# EAGLE schematic EGR 326 ATmega328P Board (EAGLE 6.4)
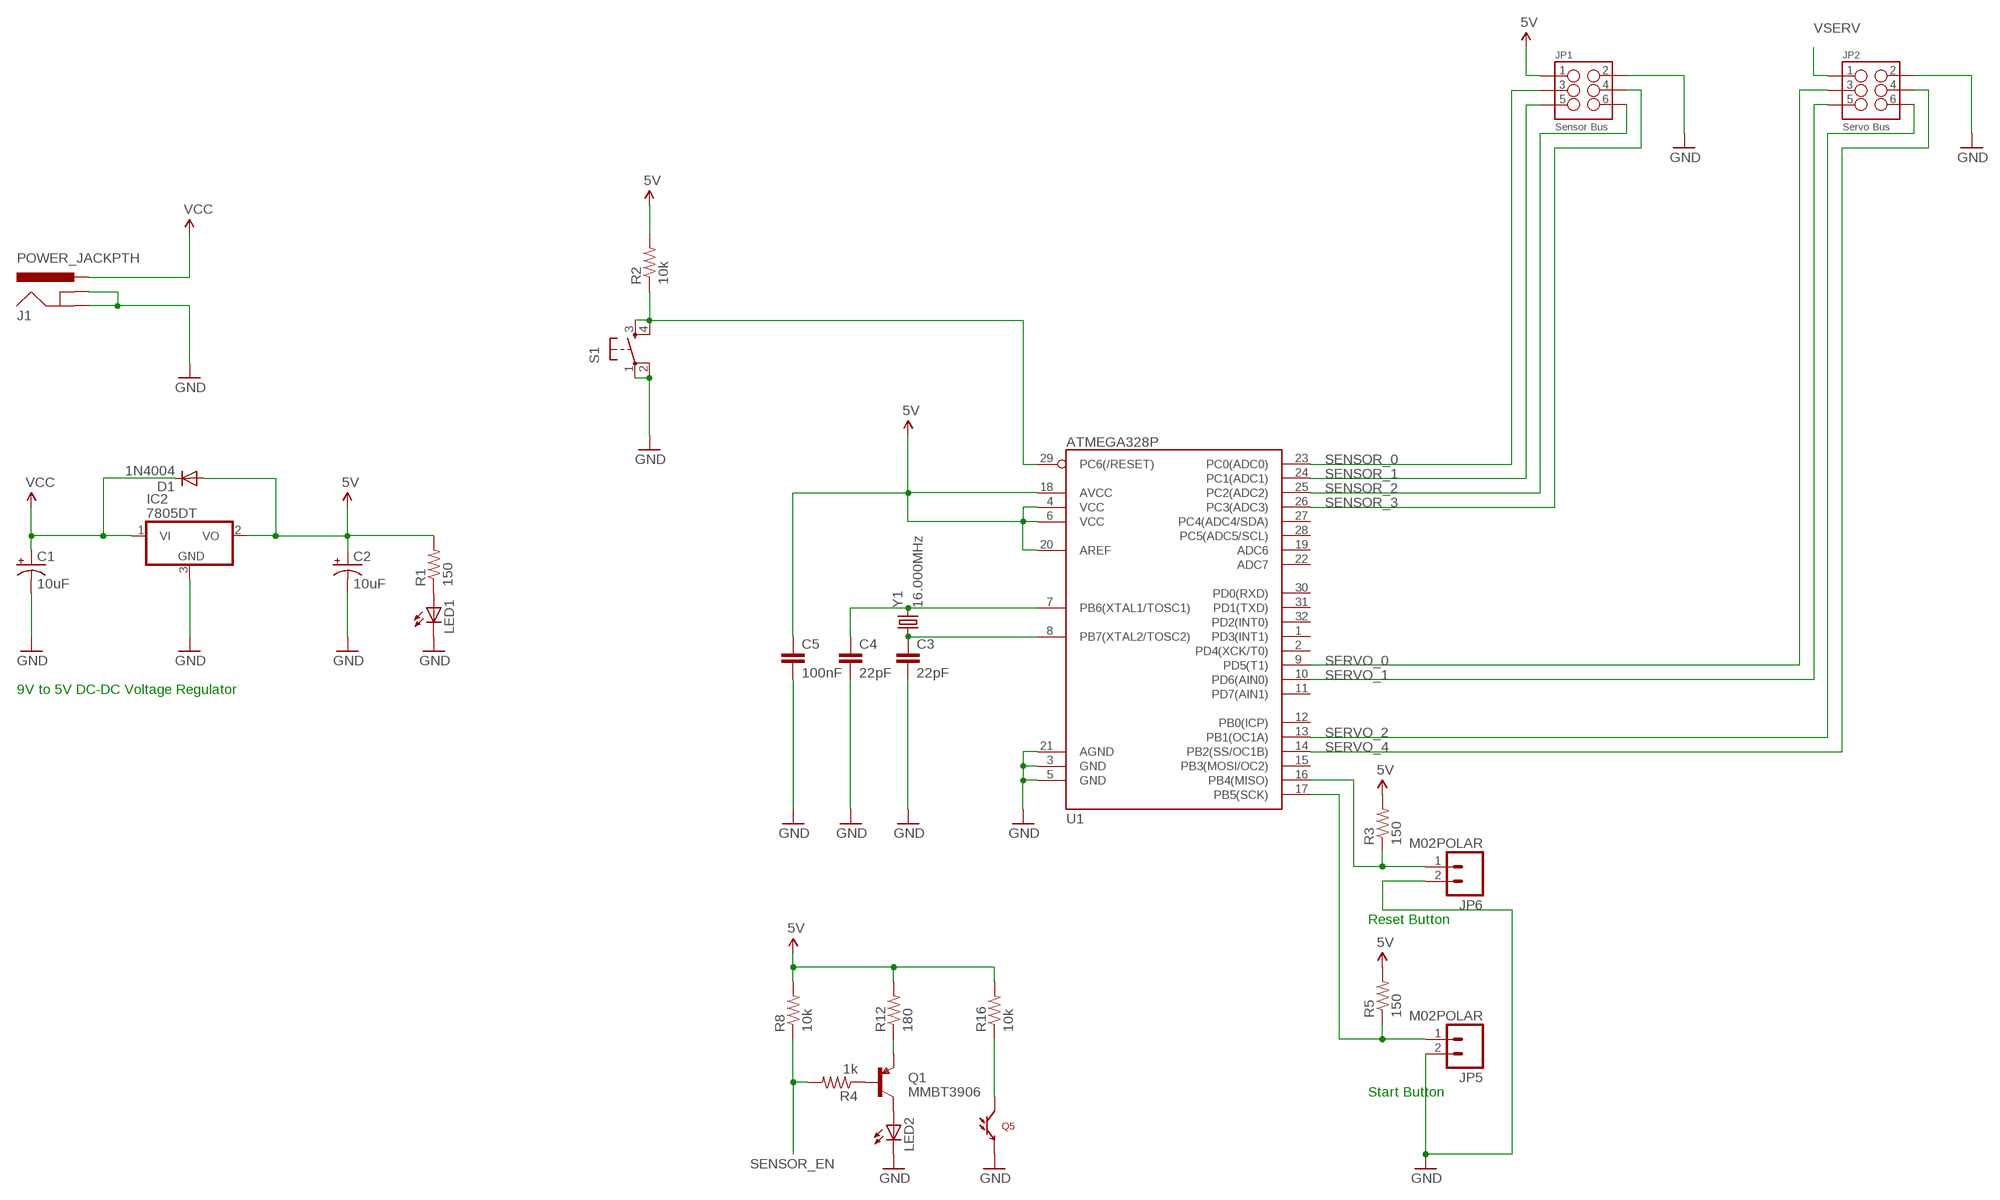
[diagram p0: schematic, sheet 1]

## Parts
C1  10uF  CAP_POLD  [PANASONIC_D]
C2  10uF  CAP_POLD  [PANASONIC_D]
C3  22pF  22PF-50V-5%(0603)  [0603-CAP]
C4  22pF  22PF-50V-5%(0603)  [0603-CAP]
C5  100nF  22PF-50V-5%(0603)  [0603-CAP]
D1  1N4004  [DO41-10]
IC2  7805DT  [TO252]
J1  POWER_JACKPTH  [POWER_JACK_PTH]
JP1  Sensor Bus  M03X2  [2X3-SHROUDED]
JP2  Servo Bus  M03X2  [2X3-SHROUDED]
JP5  M02POLAR  [MOLEX-1X2]
JP6  M02POLAR  [MOLEX-1X2]
LED1  LED1206  [LED-1206]
LED2  LED3MM  [LED3MM]
Q1  MMBT3906  TRANSISTOR_PNPMMBT3906  [SOT23]
Q5  LTR-301  [LTR-301]
R1  150  RESISTOR0603  [0603-RES]
R2  10k  RESISTOR0603  [0603-RES]
R3  150  RESISTOR0603  [0603-RES]
R4  1k  RESISTOR0603  [0603-RES]
R5  150  RESISTOR0603  [0603-RES]
R8  10k  RESISTOR0603  [0603-RES]
R12  180  RESISTOR0603  [0603-RES]
R16  10k  RESISTOR0603  [0603-RES]
S1  TAC_SWITCHSMD  [TACTILE_SWITCH_SMD]
U1  ATMEGA328P  ATMEGA328_SMT  [TQFP32-08]
Y1  16.000MHz  CRYSTALSMD  [HC49UP]

## Nets
5V: C2.+ C5.1 D1.A IC2.2(VO) JP1.1 R1.2 R2.2 R3.2 R5.2 R8.2 R12.2 R16.2 U1.4(VCC) U1.6(VCC) U1.18(AVCC) U1.20(AREF)
GND: C1.- C2.- C3.2 C4.2 C5.2 IC2.3(GND) J1.GND J1.GNDBREAK JP1.2 JP2.2 JP5.2 JP6.2 LED1.C LED2.K(C) Q5.E S1.1 S1.2 U1.3(GND) U1.5(GND) U1.21(AGND)
N$1: LED1.A R1.1
N$2: C4.1 U1.7(PB6(XTAL1/TOSC1)) Y1.2
N$3: C3.1 U1.8(PB7(XTAL2/TOSC2)) Y1.1
N$4: Q1.1(B) R4.1
N$5: R2.1 S1.3 S1.4 U1.29(PC6(/RESET))
N$6: JP6.1 R3.1 U1.16(PB4(MISO))
N$7: JP5.1 R5.1 U1.17(PB5(SCK))
N$10: Q5.C R16.1
N$13: Q1.2(E) R12.1
N$17: LED2.A Q1.3(C)
SENSOR_0: JP1.3 U1.23(PC0(ADC0))
SENSOR_1: JP1.5 U1.24(PC1(ADC1))
SENSOR_2: JP1.6 U1.25(PC2(ADC2))
SENSOR_3: JP1.4 U1.26(PC3(ADC3))
SENSOR_EN: R4.2 R8.1
SERVO_0: JP2.3 U1.9(PD5(T1))
SERVO_1: JP2.5 U1.10(PD6(AIN0))
SERVO_2: JP2.6 U1.13(PB1(OC1A))
SERVO_4: JP2.4 U1.14(PB2(SS/OC1B))
VCC: C1.+ D1.C IC2.1(VI) J1.PWR
VSERV: JP2.1
Unconnected: U1.1(PD3(INT1)) U1.2(PD4(XCK/T0)) U1.11(PD7(AIN1)) U1.12(PB0(ICP)) U1.15(PB3(MOSI/OC2)) U1.19(ADC6) U1.22(ADC7) U1.27(PC4(ADC4/SDA)) U1.28(PC5(ADC5/SCL)) U1.30(PD0(RXD)) U1.31(PD1(TXD)) U1.32(PD2(INT0))

## Notes on the sheet
- 9V to 5V DC-DC Voltage Regulator
- Reset Button
- Start Button

## Library data of the parts
C1 C2 = SparkFun-Capacitors:CAP_POL: Capacitor Polarized These are standard SMD and PTH capacitors. Normally 10uF, 47uF, and 100uF in electrolytic and tantalum varieties. Always verify the external diameter of the through hole cap, it varies with capacity, voltage, and manufacturer. The EIA devices should be standard.
C3 C4 = SparkFun-Capacitors:22PF-50V-5%(0603): CAP-07876; PROD_ID: CAP-07876
C5 = SparkFun-Capacitors:22PF-50V-5%(0603): CAP-07876; PROD_ID: CAP-07876; VALUE: 22pF
D1 = diode:1N4004: DIODE general purpose rectifier, 1 A
IC2 = linear:78*: Positive VOLTAGE REGULATOR Source: http://cache.national.com/ds/LM/LM78L05.pdf http://www.fairchildsemi.com/ds/LM/LM7805.pdf
J1 = SparkFun-Connectors:POWER_JACK: Power Jack This is the standard 5.5mm barrel jack for power. The PTH is the most common, proven, reliable, footprint. The Slot footprint only works if the mill layer is transmitted to the PCB fab house so be warned. Spark Fun Electronics SKU : PRT-00119 SMT: CONN-08106 Mating wall wart : TOL-00298 (and others)
JP1 JP2 = SparkFun-Connectors:M03X2: 2x3 .1" header. Shrouded, with keying- CONN-10681 SMT- CONN-11415 Pogo pins- HW-11044; PROD_ID: CONN-10681
JP5 JP6 = SparkFun-Connectors:M02: Standard 2-pin 0.1" header. Use with - straight break away headers ( PRT-00116) - right angle break away headers (PRT-00553) - swiss pins (PRT-00743) - machine pins (PRT-00117) - female headers (PRT-00115) Molex polarized connector foot print use with: PRT-08233 with associated crimp pins and housings. 2.54_SCREWTERM for use with PRT-10571. 3.5mm Screw Terminal footprints for PRT-08084 5mm Screw Terminal footprints for use with PRT-08433
LED1 LED2 = SparkFun-LED:LED: LEDs Standard schematic elements and footprints for 5mm, 3mm, 1206, and 0603 sized LEDs. 5mm - Spark Fun Electronics SKU : COM-00529 (and others)
Q1 = SparkFun-DiscreteSemi:TRANSISTOR_PNP: Generic PNP BJT Double check pinouts against datasheets- not all devices are the same! MMBT3906 - 40V 200mA SOT-23 (TRANS-08052) MMBT4403 - 40V 600mA SOT-23 (TRANS-09245); PROD_ID: TRANS-08052
Q5 = SparkFun-Sensors:LTR-301: Through-hole side-receiving IR phototransistor
R1-R5 R8 R12 R16 = SparkFun-Resistors:RESISTOR: Resistor Basic schematic elements and footprints for 0603, 1206, and PTH resistors.
S1 = SparkFun-Electromechanical:TAC_SWITCH: Momentary Switch Button commonly used for reset or general input. Spark Fun Electronics SKU : COM-00097 SMT- SWCH-08247; PROD_ID: SWCH-08247
U1 = SparkFun-DigitalIC:ATMEGA328_SMT: 32-Pin Atmega328 part Commonly used on Arduino compatible boards Available in QFP and QFN packages TQFP is IC-09069 QFN is non-stock; PROD_ID: IC-09069
Y1 = SparkFun-FreqCtrl:CRYSTAL: Various standard crystals. Proven footprints. Spark Fun Electronics SKU : COM-00534